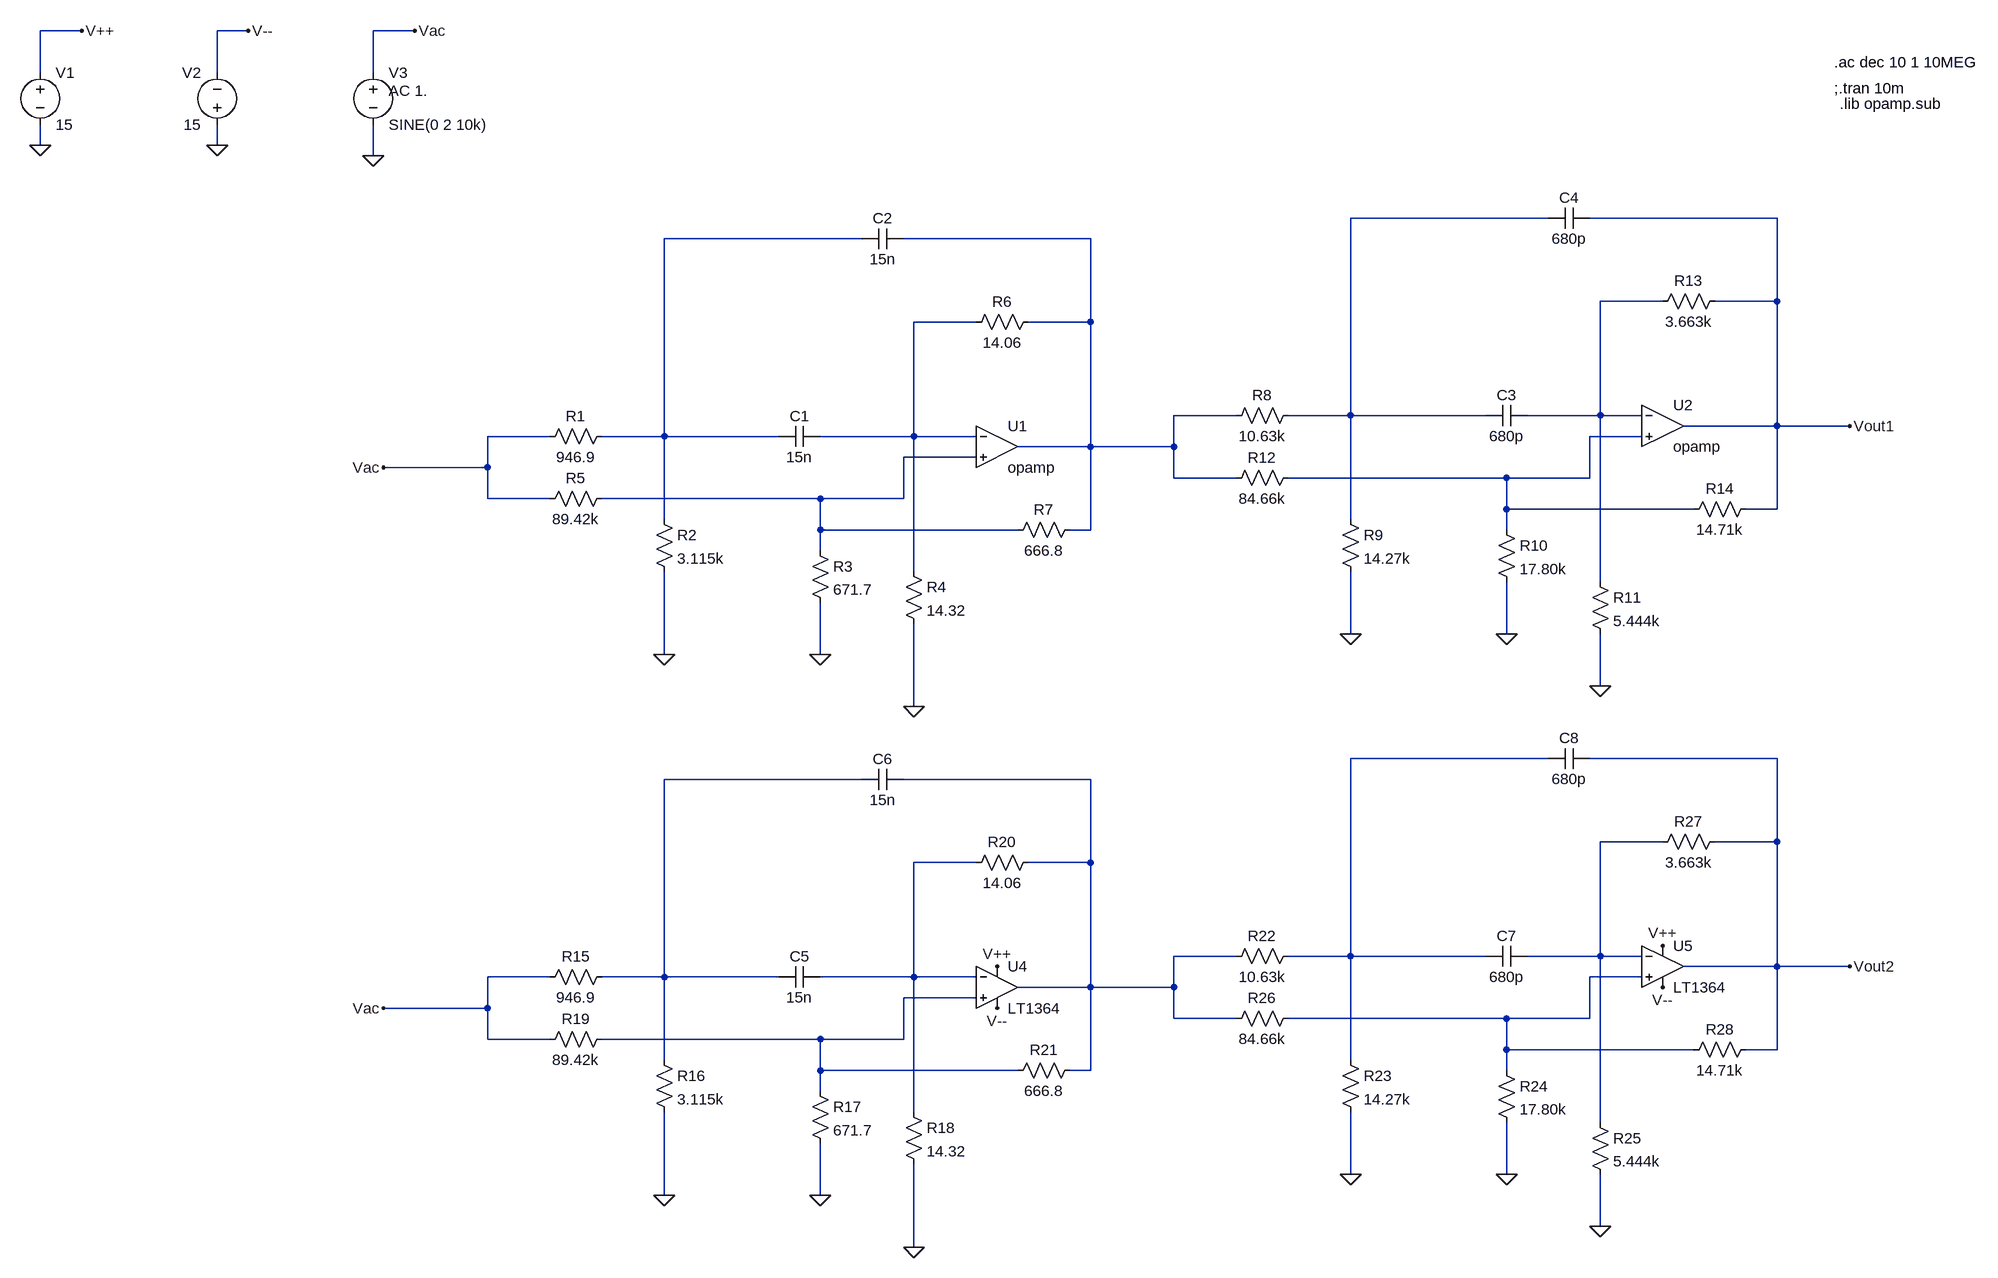
[diagram p0: schematic LT1364_Cauer_SK.asc]
LT1364_Cauer_SK.asc, the LTspice schematic file:
Version 4
SHEET 1 1992 1460
WIRE -1504 -464 -1568 -464
WIRE -1248 -464 -1296 -464
WIRE -992 -464 -1056 -464
WIRE -1568 -400 -1568 -464
WIRE -1296 -400 -1296 -464
WIRE -1056 -400 -1056 -464
WIRE -1568 -288 -1568 -320
WIRE -1296 -288 -1296 -320
WIRE -1056 -272 -1056 -320
WIRE 752 -176 448 -176
WIRE 1104 -176 816 -176
WIRE -304 -144 -608 -144
WIRE 48 -144 -240 -144
WIRE 928 -48 832 -48
WIRE 1104 -48 1104 -176
WIRE 1104 -48 1008 -48
WIRE -128 -16 -224 -16
WIRE 48 -16 48 -144
WIRE 48 -16 -48 -16
WIRE 272 128 176 128
WIRE 448 128 448 -176
WIRE 448 128 352 128
WIRE 656 128 448 128
WIRE 832 128 832 -48
WIRE 832 128 720 128
WIRE 896 128 832 128
WIRE 1104 144 1104 -48
WIRE 1104 144 960 144
WIRE 1216 144 1104 144
WIRE -784 160 -880 160
WIRE -608 160 -608 -144
WIRE -608 160 -704 160
WIRE -432 160 -608 160
WIRE -224 160 -224 -16
WIRE -224 160 -368 160
WIRE -128 160 -224 160
WIRE 896 160 816 160
WIRE 48 176 48 -16
WIRE 48 176 -64 176
WIRE 176 176 176 128
WIRE 176 176 48 176
WIRE -128 192 -240 192
WIRE -880 208 -880 160
WIRE -880 208 -1040 208
WIRE 176 224 176 176
WIRE 272 224 176 224
WIRE 688 224 352 224
WIRE 816 224 816 160
WIRE 816 224 688 224
WIRE -880 256 -880 208
WIRE -784 256 -880 256
WIRE -368 256 -704 256
WIRE -240 256 -240 192
WIRE -240 256 -368 256
WIRE 688 272 688 224
WIRE 976 272 688 272
WIRE 1104 272 1104 144
WIRE 1104 272 1056 272
WIRE -608 288 -608 160
WIRE 448 288 448 128
WIRE -368 304 -368 256
WIRE -64 304 -368 304
WIRE 48 304 48 176
WIRE 48 304 16 304
WIRE 688 304 688 272
WIRE -368 336 -368 304
WIRE -224 368 -224 160
WIRE 832 384 832 128
WIRE 448 464 448 368
WIRE 688 464 688 384
WIRE -608 496 -608 368
WIRE -368 496 -368 416
WIRE 832 544 832 464
WIRE -224 576 -224 448
WIRE 752 656 448 656
WIRE 1104 656 816 656
WIRE -304 688 -608 688
WIRE 48 688 -240 688
WIRE 928 784 832 784
WIRE 1104 784 1104 656
WIRE 1104 784 1008 784
WIRE -128 816 -224 816
WIRE 48 816 48 688
WIRE 48 816 -48 816
WIRE 272 960 176 960
WIRE 448 960 448 656
WIRE 448 960 352 960
WIRE 656 960 448 960
WIRE 832 960 832 784
WIRE 832 960 720 960
WIRE 896 960 832 960
WIRE 1104 976 1104 784
WIRE 1104 976 960 976
WIRE 1216 976 1104 976
WIRE -784 992 -880 992
WIRE -608 992 -608 688
WIRE -608 992 -704 992
WIRE -432 992 -608 992
WIRE -224 992 -224 816
WIRE -224 992 -368 992
WIRE -128 992 -224 992
WIRE 896 992 816 992
WIRE 48 1008 48 816
WIRE 48 1008 -64 1008
WIRE 176 1008 176 960
WIRE 176 1008 48 1008
WIRE -128 1024 -240 1024
WIRE -880 1040 -880 992
WIRE -880 1040 -1040 1040
WIRE 176 1056 176 1008
WIRE 272 1056 176 1056
WIRE 688 1056 352 1056
WIRE 816 1056 816 992
WIRE 816 1056 688 1056
WIRE -880 1088 -880 1040
WIRE -784 1088 -880 1088
WIRE -368 1088 -704 1088
WIRE -240 1088 -240 1024
WIRE -240 1088 -368 1088
WIRE 688 1104 688 1056
WIRE 976 1104 688 1104
WIRE 1104 1104 1104 976
WIRE 1104 1104 1056 1104
WIRE -608 1120 -608 992
WIRE 448 1120 448 960
WIRE -368 1136 -368 1088
WIRE -64 1136 -368 1136
WIRE 48 1136 48 1008
WIRE 48 1136 16 1136
WIRE 688 1136 688 1104
WIRE -368 1168 -368 1136
WIRE -224 1200 -224 992
WIRE 832 1216 832 960
WIRE 448 1296 448 1200
WIRE 688 1296 688 1216
WIRE -608 1328 -608 1200
WIRE -368 1328 -368 1248
WIRE 832 1376 832 1296
WIRE -224 1408 -224 1280
FLAG -608 496 0
FLAG -368 496 0
FLAG -224 576 0
FLAG 448 464 0
FLAG 688 464 0
FLAG 832 544 0
FLAG -1040 208 Vac
FLAG -1568 -288 0
FLAG -1296 -288 0
FLAG -1504 -464 V++
FLAG -1248 -464 V--
FLAG -1056 -272 0
FLAG -992 -464 Vac
FLAG -96 1040 V--
FLAG -96 976 V++
FLAG 928 1008 V--
FLAG 928 944 V++
FLAG 1216 144 Vout1
FLAG -608 1328 0
FLAG -368 1328 0
FLAG -224 1408 0
FLAG 448 1296 0
FLAG 688 1296 0
FLAG 832 1376 0
FLAG -1040 1040 Vac
FLAG 1216 976 Vout2
SYMBOL res -688 144 R90
WINDOW 0 0 56 VBottom 2
WINDOW 3 32 56 VTop 2
SYMATTR InstName R1
SYMATTR Value 946.9
SYMBOL cap -368 144 R90
WINDOW 0 0 32 VBottom 2
WINDOW 3 32 32 VTop 2
SYMATTR InstName C1
SYMATTR Value 15n
SYMBOL res -624 272 R0
SYMATTR InstName R2
SYMATTR Value 3.115k
SYMBOL res -384 320 R0
SYMATTR InstName R3
SYMATTR Value 671.7
SYMBOL res -240 352 R0
SYMATTR InstName R4
SYMATTR Value 14.32
SYMBOL cap -240 -160 R90
WINDOW 0 0 32 VBottom 2
WINDOW 3 32 32 VTop 2
SYMATTR InstName C2
SYMATTR Value 15n
SYMBOL res -688 240 R90
WINDOW 0 0 56 VBottom 2
WINDOW 3 32 56 VTop 2
SYMATTR InstName R5
SYMATTR Value 89.42k
SYMBOL res -32 -32 R90
WINDOW 0 0 56 VBottom 2
WINDOW 3 32 56 VTop 2
SYMATTR InstName R6
SYMATTR Value 14.06
SYMBOL res 32 288 R90
WINDOW 0 0 56 VBottom 2
WINDOW 3 32 56 VTop 2
SYMATTR InstName R7
SYMATTR Value 666.8
SYMBOL res 368 112 R90
WINDOW 0 0 56 VBottom 2
WINDOW 3 32 56 VTop 2
SYMATTR InstName R8
SYMATTR Value 10.63k
SYMBOL cap 720 112 R90
WINDOW 0 0 32 VBottom 2
WINDOW 3 32 32 VTop 2
SYMATTR InstName C3
SYMATTR Value 680p
SYMBOL res 432 272 R0
SYMATTR InstName R9
SYMATTR Value 14.27k
SYMBOL res 672 288 R0
SYMATTR InstName R10
SYMATTR Value 17.80k
SYMBOL res 816 368 R0
SYMATTR InstName R11
SYMATTR Value 5.444k
SYMBOL cap 816 -192 R90
WINDOW 0 0 32 VBottom 2
WINDOW 3 32 32 VTop 2
SYMATTR InstName C4
SYMATTR Value 680p
SYMBOL res 368 208 R90
WINDOW 0 0 56 VBottom 2
WINDOW 3 32 56 VTop 2
SYMATTR InstName R12
SYMATTR Value 84.66k
SYMBOL res 1024 -64 R90
WINDOW 0 0 56 VBottom 2
WINDOW 3 32 56 VTop 2
SYMATTR InstName R13
SYMATTR Value 3.663k
SYMBOL res 1072 256 R90
WINDOW 0 0 56 VBottom 2
WINDOW 3 32 56 VTop 2
SYMATTR InstName R14
SYMATTR Value 14.71k
SYMBOL voltage -1568 -416 R0
WINDOW 123 0 0 Left 0
WINDOW 39 0 0 Left 0
SYMATTR InstName V1
SYMATTR Value 15
SYMBOL voltage -1296 -304 R180
WINDOW 0 24 96 Left 2
WINDOW 3 24 16 Left 2
SYMATTR InstName V2
SYMATTR Value 15
SYMBOL voltage -1056 -416 R0
WINDOW 123 24 44 Left 2
WINDOW 39 0 0 Left 0
SYMATTR Value2 AC 1.
SYMATTR InstName V3
SYMATTR Value SINE(0 2 10k)
SYMBOL Opamps\\LT1364 -96 944 R0
SYMATTR InstName U4
SYMBOL Opamps\\LT1364 928 912 R0
SYMATTR InstName U5
SYMBOL Opamps\\opamp -96 112 R0
SYMATTR InstName U1
SYMATTR SpiceLine2 GBW=70Meg
SYMBOL Opamps\\opamp 928 80 R0
SYMATTR InstName U2
SYMATTR SpiceLine2 GBW=70Meg
SYMBOL res -688 976 R90
WINDOW 0 0 56 VBottom 2
WINDOW 3 32 56 VTop 2
SYMATTR InstName R15
SYMATTR Value 946.9
SYMBOL cap -368 976 R90
WINDOW 0 0 32 VBottom 2
WINDOW 3 32 32 VTop 2
SYMATTR InstName C5
SYMATTR Value 15n
SYMBOL res -624 1104 R0
SYMATTR InstName R16
SYMATTR Value 3.115k
SYMBOL res -384 1152 R0
SYMATTR InstName R17
SYMATTR Value 671.7
SYMBOL res -240 1184 R0
SYMATTR InstName R18
SYMATTR Value 14.32
SYMBOL cap -240 672 R90
WINDOW 0 0 32 VBottom 2
WINDOW 3 32 32 VTop 2
SYMATTR InstName C6
SYMATTR Value 15n
SYMBOL res -688 1072 R90
WINDOW 0 0 56 VBottom 2
WINDOW 3 32 56 VTop 2
SYMATTR InstName R19
SYMATTR Value 89.42k
SYMBOL res -32 800 R90
WINDOW 0 0 56 VBottom 2
WINDOW 3 32 56 VTop 2
SYMATTR InstName R20
SYMATTR Value 14.06
SYMBOL res 32 1120 R90
WINDOW 0 0 56 VBottom 2
WINDOW 3 32 56 VTop 2
SYMATTR InstName R21
SYMATTR Value 666.8
SYMBOL res 368 944 R90
WINDOW 0 0 56 VBottom 2
WINDOW 3 32 56 VTop 2
SYMATTR InstName R22
SYMATTR Value 10.63k
SYMBOL cap 720 944 R90
WINDOW 0 0 32 VBottom 2
WINDOW 3 32 32 VTop 2
SYMATTR InstName C7
SYMATTR Value 680p
SYMBOL res 432 1104 R0
SYMATTR InstName R23
SYMATTR Value 14.27k
SYMBOL res 672 1120 R0
SYMATTR InstName R24
SYMATTR Value 17.80k
SYMBOL res 816 1200 R0
SYMATTR InstName R25
SYMATTR Value 5.444k
SYMBOL cap 816 640 R90
WINDOW 0 0 32 VBottom 2
WINDOW 3 32 32 VTop 2
SYMATTR InstName C8
SYMATTR Value 680p
SYMBOL res 368 1040 R90
WINDOW 0 0 56 VBottom 2
WINDOW 3 32 56 VTop 2
SYMATTR InstName R26
SYMATTR Value 84.66k
SYMBOL res 1024 768 R90
WINDOW 0 0 56 VBottom 2
WINDOW 3 32 56 VTop 2
SYMATTR InstName R27
SYMATTR Value 3.663k
SYMBOL res 1072 1088 R90
WINDOW 0 0 56 VBottom 2
WINDOW 3 32 56 VTop 2
SYMATTR InstName R28
SYMATTR Value 14.71k
TEXT 1192 -416 Left 2 !.ac dec 10 1 10MEG
TEXT 1192 -376 Left 2 !;.tran 10m
TEXT 1200 -352 Left 2 !.lib opamp.sub

The netlist it stands for:
* LT1364_Cauer_SK.asc
R1 N002 Vac 946.9
C1 N005 N002 15n
R2 N002 0 3.115k
R3 N007 0 671.7
R4 N005 0 14.32
C2 N003 N002 15n
R5 N007 Vac 89.42k
R6 N003 N005 14.06
R7 N003 N007 666.8
R8 N001 N003 10.63k
C3 N004 N001 680p
R9 N001 0 14.27k
R10 N006 0 17.80k
R11 N004 0 5.444k
C4 Vout1 N001 680p
R12 N006 N003 84.66k
R13 Vout1 N004 3.663k
R14 Vout1 N006 14.71k
V1 V++ 0 15
V2 0 V-- 15
V3 Vac 0 SINE(0 2 10k) AC 1.
XU4 N014 N012 V++ V-- N010 LT1363  ; LT1364, pins In+ In- V+ V- OUT
XU5 N013 N011 V++ V-- Vout2 LT1363  ; LT1364, pins In+ In- V+ V- OUT
XU1 N005 N007 N003 opamp Aol=100K GBW=70Meg  ; pins invin noninvin out
XU2 N004 N006 Vout1 opamp Aol=100K GBW=70Meg  ; pins invin noninvin out
R15 N009 Vac 946.9
C5 N012 N009 15n
R16 N009 0 3.115k
R17 N014 0 671.7
R18 N012 0 14.32
C6 N010 N009 15n
R19 N014 Vac 89.42k
R20 N010 N012 14.06
R21 N010 N014 666.8
R22 N008 N010 10.63k
C7 N011 N008 680p
R23 N008 0 14.27k
R24 N013 0 17.80k
R25 N011 0 5.444k
C8 Vout2 N008 680p
R26 N013 N010 84.66k
R27 Vout2 N011 3.663k
R28 Vout2 N013 14.71k
.ac dec 10 1 10MEG
;.tran 10m
.lib opamp.sub
.lib LTC.lib
.backanno
.end